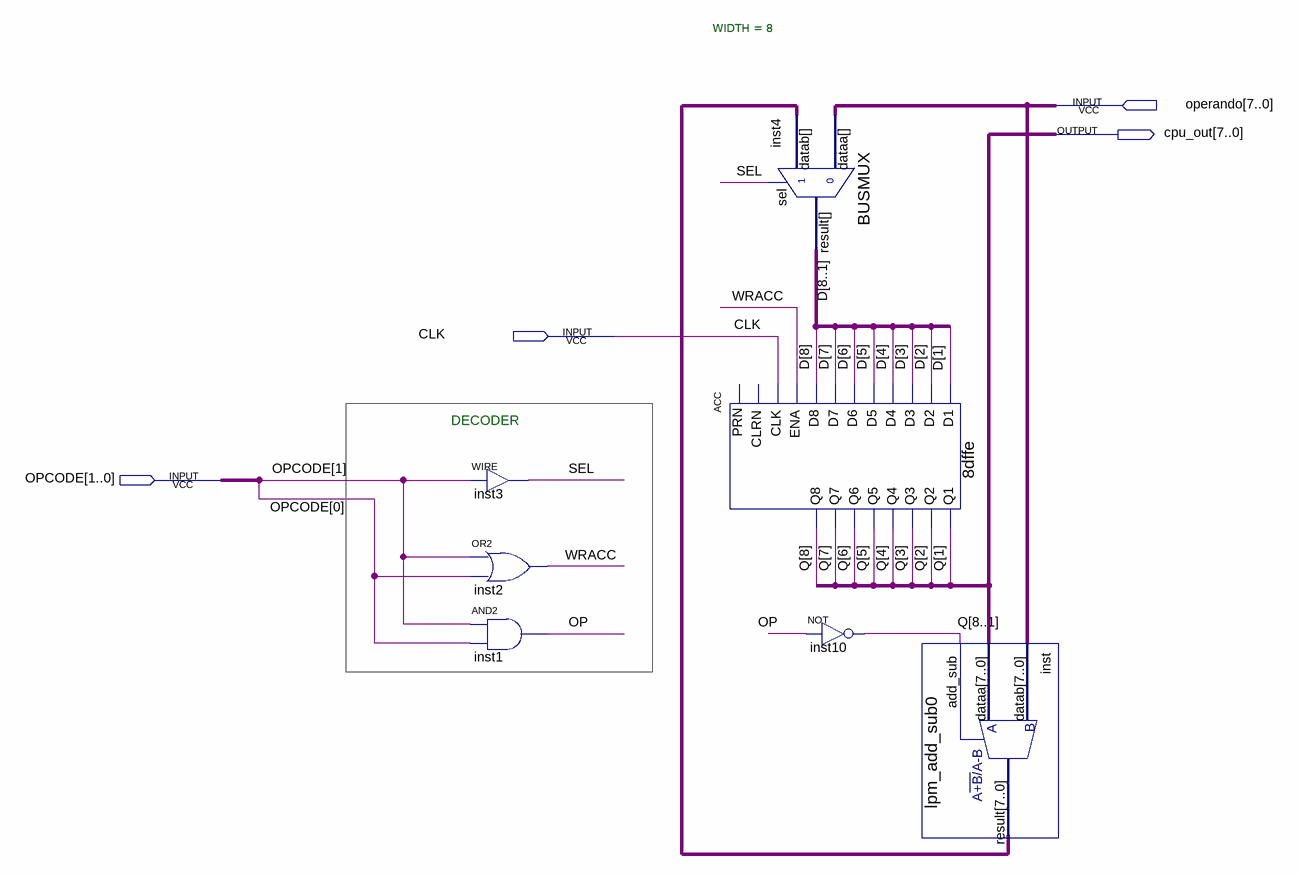
[diagram p0: schematic sheet]
// Quartus schematic first_cpu-v1.bdf as structural Verilog: 7 symbols, 4 pins
module \first_cpu-v1  (
  input  [7:0] operando,
  input  CLK,
  input  [1:0] OPCODE,
  output [7:0] cpu_out
);

  wire inst10_out, OP, SEL, WRACC;
  wire [7:0] inst_result;
  wire [8:1] D;

  assign SEL = OPCODE[1];  // WIRE inst3
  or inst2 (WRACC, OPCODE[1], OPCODE[0]);
  and inst1 (OP, OPCODE[1], OPCODE[0]);
  \8dffe  ACC (
    .D2(D[2]), .D3(D[3]), .D4(D[4]), .D5(D[5]), .D8(D[8]), .D6(D[6]), .D7(D[7]), .CLK(CLK), .ENA(WRACC),
    .D1(D[1]), .Q8(cpu_out[7]), .Q4(cpu_out[3]), .Q6(cpu_out[5]), .Q7(cpu_out[6]), .Q3(cpu_out[2]),
    .Q2(cpu_out[1]), .Q1(cpu_out[0]), .Q5(cpu_out[4]));  // open: CLRN, PRN
  BUSMUX #(.WIDTH(8)) inst4 (.datab(inst_result), .sel(SEL), .dataa(operando), .result(D));
  not inst10 (inst10_out, OP);
  lpm_add_sub0 inst (.add_sub(inst10_out), .dataa(cpu_out), .datab(operando), .result(inst_result));

  // Other names for the same wires on the sheet: Q[8:1] = cpu_out

  // Notes on the sheet:
  //   DECODER
endmodule
